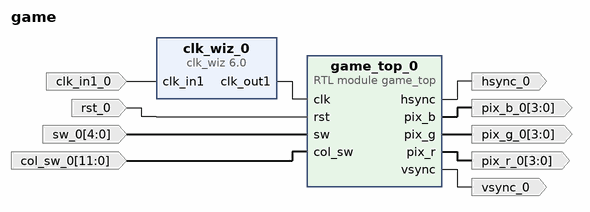
[diagram p0: block diagram of the top level]
# Vivado block design game, xc7a100tcsg324-1, Vivado 2019.1
create_bd_design game

create_bd_port -dir I -type clk clk_in1_0
create_bd_port -dir I -type rst rst_0
create_bd_port -dir I -from 4 -to 0 sw_0
create_bd_port -dir O -from 3 -to 0 pix_r_0
create_bd_port -dir O -from 3 -to 0 pix_g_0
create_bd_port -dir O -from 3 -to 0 pix_b_0
create_bd_port -dir O hsync_0
create_bd_port -dir O vsync_0
create_bd_port -dir I -from 11 -to 0 col_sw_0

create_bd_cell -type module -reference game_top game_top_0
create_bd_cell -type ip -vlnv xilinx.com:ip:clk_wiz:6.0 clk_wiz_0
set_property -dict [list \
  CONFIG.CLKOUT1_JITTER 299.155 \
  CONFIG.CLKOUT1_PHASE_ERROR 297.220 \
  CONFIG.CLKOUT1_REQUESTED_OUT_FREQ 83.46 \
  CONFIG.MMCM_CLKFBOUT_MULT_F 28.375 \
  CONFIG.MMCM_CLKOUT0_DIVIDE_F 8.500 \
  CONFIG.MMCM_DIVCLK_DIVIDE 4 \
  CONFIG.USE_LOCKED false \
  CONFIG.USE_RESET false \
] [get_bd_cells clk_wiz_0]

# ---- connections ----

connect_bd_net [get_bd_pins clk_wiz_0/clk_out1] [get_bd_pins game_top_0/clk]
connect_bd_net -net clk_in1_0_1 [get_bd_ports clk_in1_0] [get_bd_pins clk_wiz_0/clk_in1]
connect_bd_net -net rst_0_1 [get_bd_ports rst_0] [get_bd_pins game_top_0/rst]
connect_bd_net -net sw_0_1 [get_bd_ports sw_0] [get_bd_pins game_top_0/sw]
connect_bd_net [get_bd_pins game_top_0/pix_r] [get_bd_ports pix_r_0]
connect_bd_net [get_bd_pins game_top_0/pix_g] [get_bd_ports pix_g_0]
connect_bd_net [get_bd_pins game_top_0/pix_b] [get_bd_ports pix_b_0]
connect_bd_net [get_bd_pins game_top_0/hsync] [get_bd_ports hsync_0]
connect_bd_net [get_bd_pins game_top_0/vsync] [get_bd_ports vsync_0]
connect_bd_net -net col_sw_0_1 [get_bd_ports col_sw_0] [get_bd_pins game_top_0/col_sw]

validate_bd_design
save_bd_design
